# Altium schematic sheet Entradas Analogicas.SchDoc
size A4
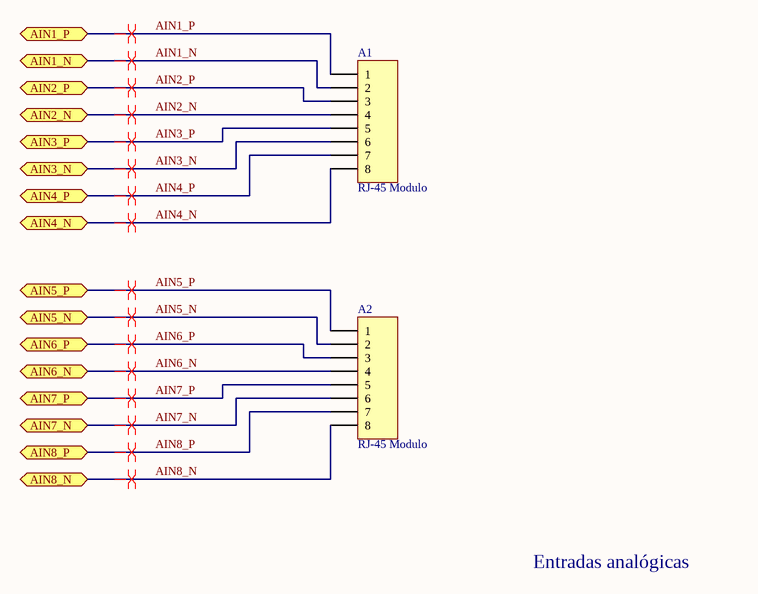
[diagram p0: Entradas Analogicas.SchDoc]

## Parts
A1  RJ-45 Modulo  [RJ45 1 Modulo SMD]
A2  RJ-45 Modulo  [RJ45 1 Modulo SMD]

## Ports
AIN1_N (bidir), AIN1_P (bidir), AIN2_N (bidir), AIN2_P (bidir), AIN3_N (bidir), AIN3_P (bidir), AIN4_N (bidir), AIN4_P (bidir), AIN5_N (bidir), AIN5_P (bidir), AIN6_N (bidir), AIN6_P (bidir), AIN7_N (bidir), AIN7_P (bidir), AIN8_N (bidir), AIN8_P (bidir)

## Nets
AIN1_N: A1.2 ; port AIN1_N
AIN1_P: A1.1 ; port AIN1_P
AIN2_N: A1.4 ; port AIN2_N
AIN2_P: A1.3 ; port AIN2_P
AIN3_N: A1.6 ; port AIN3_N
AIN3_P: A1.5 ; port AIN3_P
AIN4_N: A1.8 ; port AIN4_N
AIN4_P: A1.7 ; port AIN4_P
AIN5_N: A2.2 ; port AIN5_N
AIN5_P: A2.1 ; port AIN5_P
AIN6_N: A2.4 ; port AIN6_N
AIN6_P: A2.3 ; port AIN6_P
AIN7_N: A2.6 ; port AIN7_N
AIN7_P: A2.5 ; port AIN7_P
AIN8_N: A2.8 ; port AIN8_N
AIN8_P: A2.7 ; port AIN8_P

## Layout directives
differential pair: AIN1_N, AIN1_P, AIN2_N, AIN2_P, AIN3_N, AIN3_P, AIN4_N, AIN4_P, AIN5_N, AIN5_P, AIN6_N, AIN6_P, AIN7_N, AIN7_P, AIN8_N, AIN8_P

## Notes on the sheet
- Entradas analógicas

## Library data of the parts
A1 A2 = RJ45 1 modulo SMD: Modulo RJ-45 vertical SMD; Manufacturer Part-Number: 1-338088-3; LatestRevisionDate: 17-Jul-2002; LatestRevisionNote: Re-released for DXP Platform.; Publisher: Altium Limited; Digikey Part-Number: A99306CT-ND